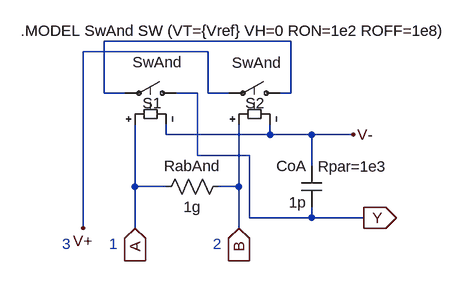
[diagram p0: schematic AndH.asc]
AndH.asc, the LTspice schematic file:
Version 4
SHEET 1 880 680
WIRE -80 432 -80 160
WIRE -48 224 -48 144
WIRE -16 224 -48 224
WIRE 0 368 0 272
WIRE 0 432 0 368
WIRE 48 288 48 272
WIRE 48 368 0 368
WIRE 96 224 64 224
WIRE 96 320 96 224
WIRE 112 160 -80 160
WIRE 112 224 112 160
WIRE 144 224 112 224
WIRE 160 368 128 368
WIRE 160 368 160 272
WIRE 160 432 160 368
WIRE 176 320 96 320
WIRE 176 416 176 320
WIRE 208 288 48 288
WIRE 208 288 208 272
WIRE 240 144 -48 144
WIRE 240 224 224 224
WIRE 240 224 240 144
WIRE 272 288 208 288
WIRE 272 336 272 288
WIRE 272 416 176 416
WIRE 272 416 272 400
WIRE 336 288 272 288
WIRE 352 416 272 416
FLAG 352 416 Y
IOPIN 352 416 Out
FLAG 0 432 A
IOPIN 0 432 In
FLAG 160 432 B
IOPIN 160 432 In
FLAG 336 288 V-
FLAG -80 432 V+
SYMBOL sw 80 224 M270
WINDOW 0 -15 39 VRight 0
WINDOW 3 48 8 VRight 0
SYMATTR InstName S1
SYMATTR Value SwAnd
SYMBOL sw 240 224 M270
WINDOW 0 -15 41 VRight 0
WINDOW 3 47 15 VRight 0
SYMATTR InstName S2
SYMATTR Value SwAnd
SYMBOL res 32 384 R270
WINDOW 0 32 56 VTop 0
WINDOW 3 0 56 VBottom 0
SYMATTR InstName RabAnd
SYMATTR Value 1g
SYMBOL cap 288 400 R180
WINDOW 0 24 64 Left 0
WINDOW 3 24 8 Left 0
WINDOW 39 -101 63 Left 0
SYMATTR InstName CoA
SYMATTR Value 1p
SYMATTR SpiceLine Rpar=1e3
TEXT -40 456 Left 0 ;1
TEXT 120 456 Left 0 ;2
TEXT -176 128 Left 0 !.MODEL SwAnd SW (VT={Vref} VH=0 RON=1e2 ROFF=1e8)
TEXT -112 456 Left 0 ;3

The netlist it stands for:
* AndH.asc
S1 Y N001 A V- SwAnd
S2 N001 V+ B V- SwAnd
RabAnd A B 1g
CoA Y V- 1p Rpar=1e3
* 1
* 2
.MODEL SwAnd SW (VT={Vref} VH=0 RON=1e2 ROFF=1e8)
* 3
.backanno
.end